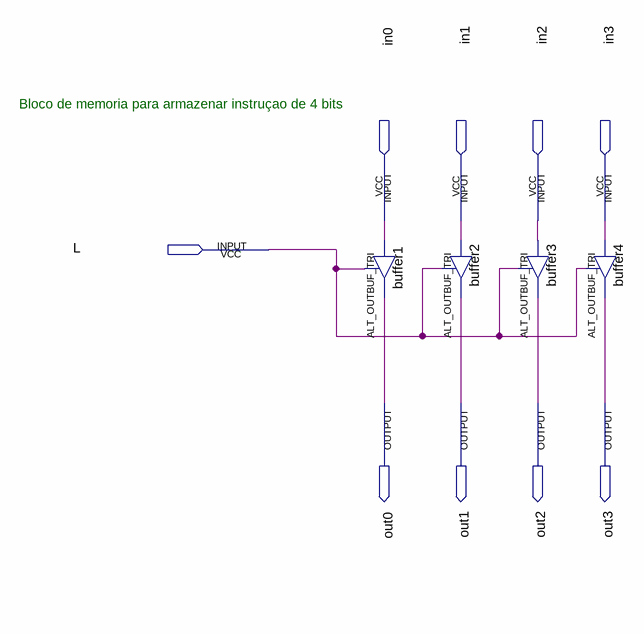
[diagram p0: schematic sheet]
// Quartus schematic bloco4bits.bdf as structural Verilog: 4 symbols, 9 pins
module bloco4bits (
  input  in0,
  input  in1,
  input  in2,
  input  in3,
  input  L,
  output out0,
  output out1,
  output out2,
  output out3
);

  ALT_OUTBUF_TRI buffer1 (.i(in0), .oe(L), .o(out0));
  ALT_OUTBUF_TRI buffer2 (.i(in1), .oe(L), .o(out1));
  ALT_OUTBUF_TRI buffer3 (.i(in2), .oe(L), .o(out2));
  ALT_OUTBUF_TRI buffer4 (.i(in3), .oe(L), .o(out3));

  // Notes on the sheet:
  //   Bloco de memoria para armazenar instruçao de 4 bits
endmodule
